# Altium schematic sheet HR911105A_C120741_HR911105A_C12074.schdoc
size 127 x 101 mm
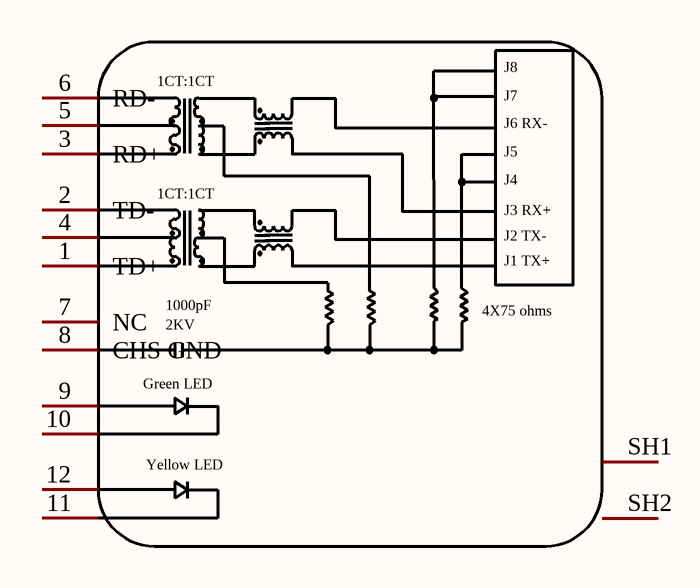
[diagram p0: HR911105A_C120741_HR911105A_C12074.schdoc]

## Parts
J?  HR911105A_C12074  [RJ45-TH_HR911105A]  (value not drawn)

## Nets

Not connected (* = marked no-connect by the designer): J? 1(TD+) 2(TD-) 3(RD+) 4 5 6(RD-) 7(NC) 8(CHS_GND) 9 10 11 12 SH1 SH2

## Notes on the sheet
- (in symbol HR911105A_C12074) J8; 1CT:1CT; J7; J6 RX-; J5; J4; J3 RX+; J2 TX-; J1 TX+; 1000pF; 4X75 ohms; 2KV; Green LED; Yellow LED

## Library data of the parts
J? = HR911105A_C12074: Manufacturer: HANRUN(汉仁); Add into BOM: yes; Connector Type: RJ插座; USOC Codes: RJ45; Number of Ports: 1; LED: 带LED; Name: HR911105A; Symbol: HR911105A_C12074; Device: HR911105A_C12074; LCSC Part Name: RJ45 带LED 带LED灯; Supplier Part: C12074; Manufacturer Part: HR911105A; Supplier Footprint: 插件; JLCPCB Part Class: Extended Part; Datasheet: https://atta.szlcsc.com/upload/public/pdf/source/20170918/C12074_1505726819496976146.pdf; Supplier: LCSC; Convert to PCB: yes; Ratings: -; Shielding: -